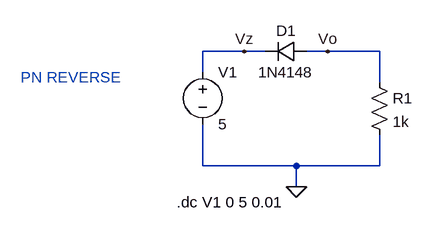
[diagram p0: schematic handdrawn_pn_reverse.asc]
handdrawn_pn_reverse.asc, the LTspice schematic file:
Version 4.1
SHEET 1 900 680
WIRE 128 112 64 112
WIRE 160 112 128 112
WIRE 256 112 224 112
WIRE 336 112 256 112
WIRE 64 144 64 112
WIRE 336 160 336 112
WIRE 64 288 64 224
WIRE 208 288 64 288
WIRE 336 288 336 240
WIRE 336 288 208 288
WIRE 208 320 208 288
FLAG 208 320 0
FLAG 128 112 Vz
FLAG 256 112 Vo
SYMBOL voltage 64 128 R0
WINDOW 123 0 0 Left 0
WINDOW 39 0 0 Left 0
SYMATTR InstName V1
SYMATTR Value 5
SYMBOL diode 224 96 R90
WINDOW 0 0 32 VBottom 2
WINDOW 3 32 32 VTop 2
SYMATTR InstName D1
SYMATTR Value 1N4148
SYMBOL res 320 144 R0
SYMATTR InstName R1
SYMATTR Value 1k
TEXT 24 344 Left 2 !.dc V1 0 5 0.01
TEXT -216 152 Left 2 ;PN REVERSE

The netlist it stands for:
* handdrawn_pn_reverse.asc
V1 Vz 0 5
D1 Vo Vz 1N4148
R1 Vo 0 1k
.model D D
.lib standard.dio
.dc V1 0 5 0.01
* PN REVERSE
.backanno
.end